# EasyEDA schematic schematic.json
TITLE: Sheet_1; REV: 1.0; Date: 2024-07-24; Sheet: 1/1; Drawn By: aaronlei; Company: Your Company
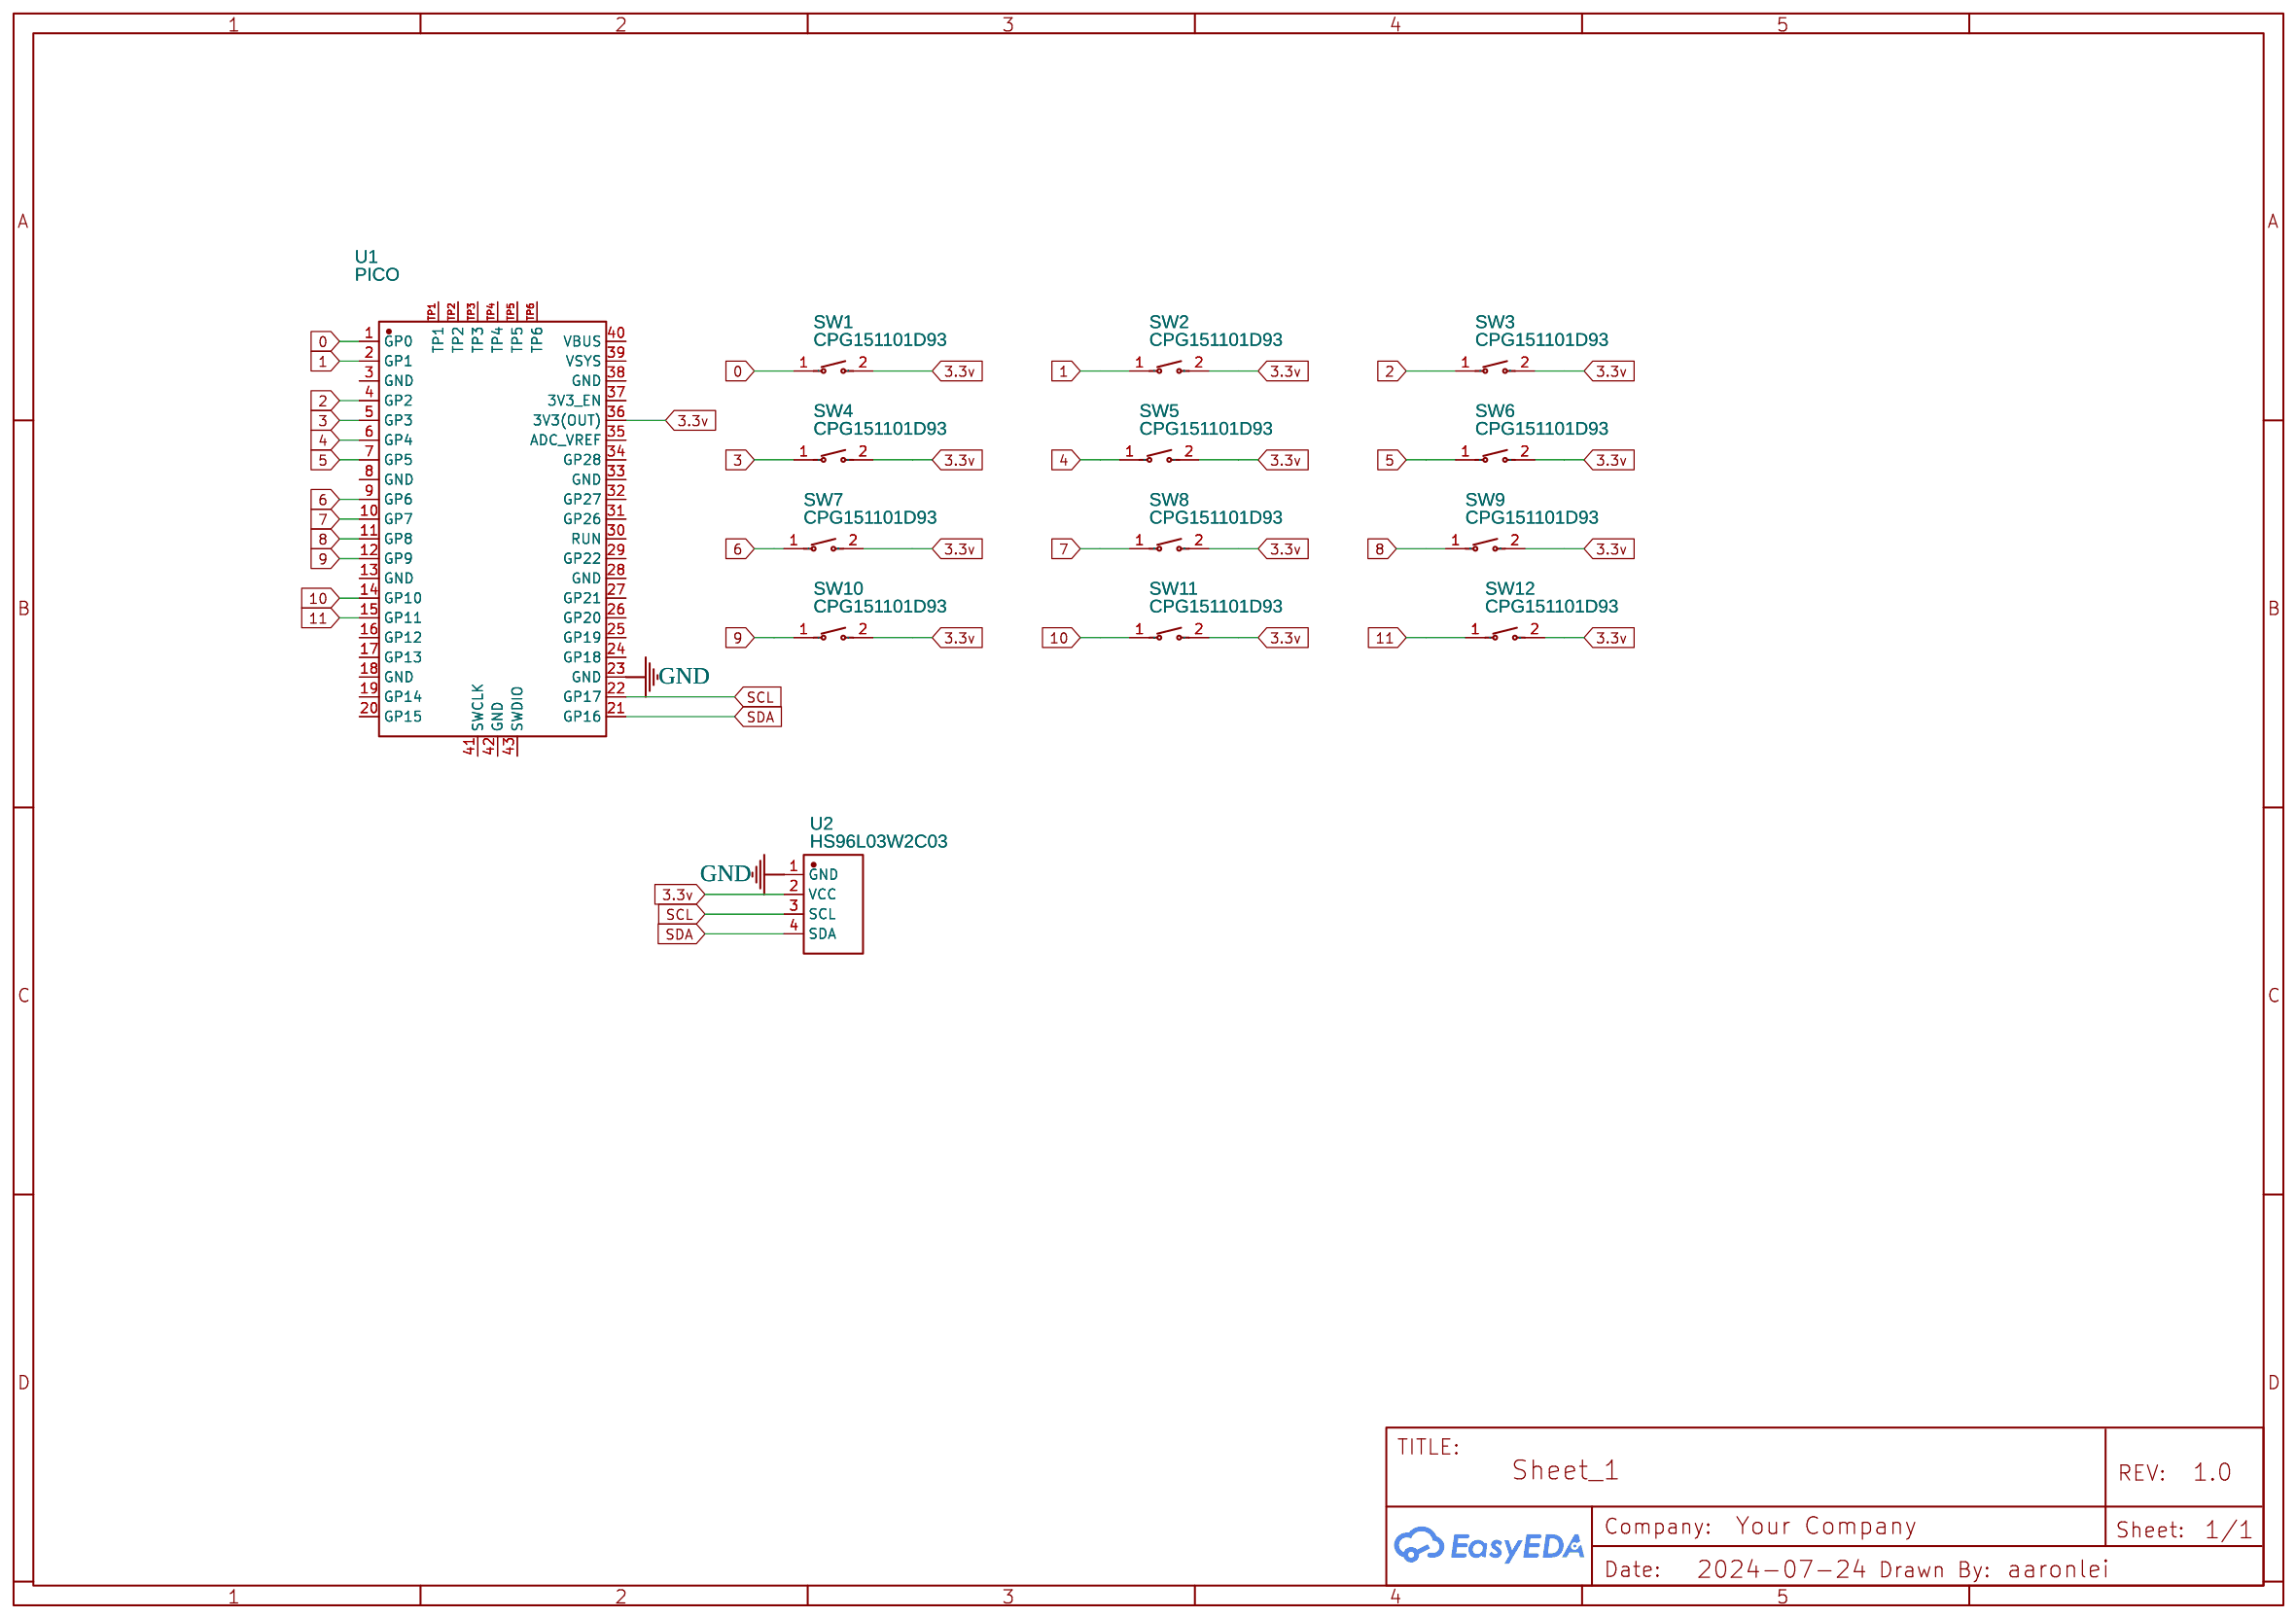
[diagram p0: schematic sheet]

## Parts
SW1  CPG151101D93  [SW-TH_CPG151101D9X]
SW2  CPG151101D93  [SW-TH_CPG151101D9X]
SW3  CPG151101D93  [SW-TH_CPG151101D9X]
SW4  CPG151101D93  [SW-TH_CPG151101D9X]
SW5  CPG151101D93  [SW-TH_CPG151101D9X]
SW6  CPG151101D93  [SW-TH_CPG151101D9X]
SW7  CPG151101D93  [SW-TH_CPG151101D9X]
SW8  CPG151101D93  [SW-TH_CPG151101D9X]
SW9  CPG151101D93  [SW-TH_CPG151101D9X]
SW10  CPG151101D93  [SW-TH_CPG151101D9X]
SW11  CPG151101D93  [SW-TH_CPG151101D9X]
SW12  CPG151101D93  [SW-TH_CPG151101D9X]
U1  PICO  [COMM-SMD_L51.0-W21.0-P2.54_SC0916]
U2  HS96L03W2C03  [OLED-TH_L27.8-W27.2-P2.54_C9900033791]

## Library data of the parts
SW1-SW12 = CPG151101D93: Contributor: LCSC; Supplier: LCSC; Supplier Part: C400237; Manufacturer: Kailh(凯华); JLCPCB Part Class: Extended Part
U1 = PICO: Supplier: LCSC; Supplier Part: C7203002; Manufacturer: Raspberry Pi(树莓派); JLCPCB Part Class: Extended Part; Contributor: lcsc
U2 = HS96L03W2C03: Contributor: lcsc; Supplier: LCSC; Supplier Part: C5248080; Manufacturer: HS(汉昇); JLCPCB Part Class: Extended Part

## Nets
3.3v: SW1.2 SW2.2 SW3.2 SW4.2 SW5.2 SW6.2 SW7.2 SW8.2 SW9.2 SW10.2 SW11.2 SW12.2 U1.36(3V3(OUT)) U2.2(VCC)
GND: U1.23(GND) U2.1(GND)
0: SW1.1 U1.1(GP0)
1: SW2.1 U1.2(GP1)
2: SW3.1 U1.4(GP2)
3: SW4.1 U1.5(GP3)
4: SW5.1 U1.6(GP4)
5: SW6.1 U1.7(GP5)
6: SW7.1 U1.9(GP6)
7: SW8.1 U1.10(GP7)
8: SW9.1 U1.11(GP8)
9: SW10.1 U1.12(GP9)
10: SW11.1 U1.14(GP10)
11: SW12.1 U1.15(GP11)
SCL: U1.22(GP17) U2.3(SCL)
SDA: U1.21(GP16) U2.4(SDA)

Not connected (* = marked no-connect by the designer): U1 3(GND) 8(GND) 13(GND) 16(GP12) 17(GP13) 18(GND) 19(GP14) 20(GP15) 24(GP18) 25(GP19) 26(GP20) 27(GP21) 28(GND) 29(GP22) 30(RUN) 31(GP26) 32(GP27) 33(GND) 34(GP28) 35(ADC_VREF) 37(3V3_EN) 38(GND) 39(VSYS) 40(VBUS) 41(SWCLK) 42(GND) 43(SWDIO) TP1 TP2 TP3 TP4 TP5 TP6
